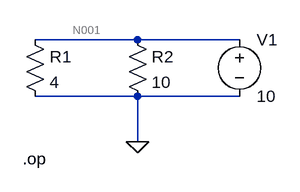
[diagram p0: schematic circuit.asc]
circuit.asc, the LTspice schematic file:
Version 4
SHEET 1 880 680
WIRE 208 128 64 128
WIRE 352 128 208 128
WIRE 208 208 64 208
WIRE 352 208 208 208
WIRE 208 272 208 208
FLAG 208 272 0
SYMBOL res 48 112 R0
SYMATTR InstName R1
SYMATTR Value 4
SYMBOL voltage 352 112 R0
SYMATTR InstName V1
SYMATTR Value 10
SYMBOL res 192 112 R0
SYMATTR InstName R2
SYMATTR Value 10
TEXT 46 296 Left 2 !.op

The netlist it stands for:
* circuit.asc
R1 N001 0 4
V1 N001 0 10
R2 N001 0 10
.op
.backanno
.end

* Results of the author's LTspice run, read from the files saved beside the schematic
* Operating Point:
*   V(n001) = 10 V
*   I(R2) = 1 A
*   I(R1) = 2.5 A
*   I(V1) = -3.5 A